# EAGLE schematic Schematic-DONE (EAGLE 9.1.3)
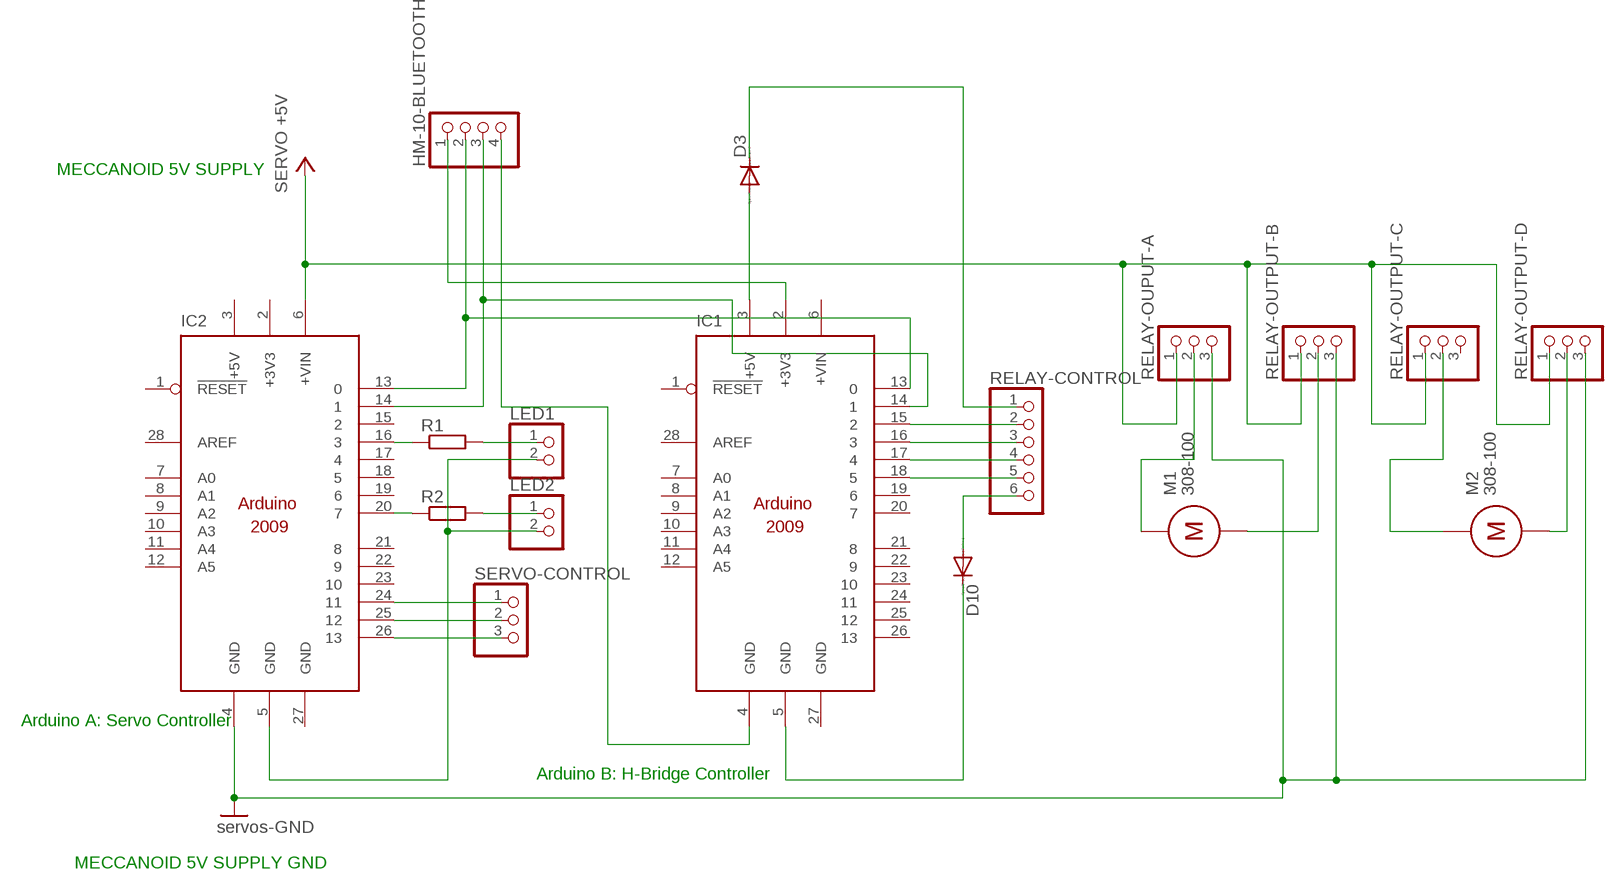
[diagram p0: schematic, sheet 1]

## Parts
D3  1N4148DO35-7  [DO35-7]
D10  1N4148DO35-7  [DO35-7]
HM-10-BLUETOOTH  PINHD-1X4  [1X04]
IC1  ARDUINO2009_10  [ARDUINO2009]
IC2  ARDUINO2009_10  [ARDUINO2009]
LED1  PINHD-1X2  [1X02]
LED2  PINHD-1X2  [1X02]
M1  308-100  [308-100]
M2  308-100  [308-100]
R1  R-EU_0204/2V  [0204V]
R2  R-EU_0204/2V  [0204V]
RELAY-CONTROL  PINHD-1X6  [1X06]
RELAY-OUPUT-A  PINHD-1X3  [1X03]
RELAY-OUTPUT-B  PINHD-1X3  [1X03]
RELAY-OUTPUT-C  PINHD-1X3  [1X03]
RELAY-OUTPUT-D  PINHD-1X3  [1X03]
SERVO-CONTROL  PINHD-1X3  [1X03]

## Nets
+5V: IC2.6(+VIN) RELAY-OUPUT-A.1 RELAY-OUTPUT-B.1 RELAY-OUTPUT-C.1 RELAY-OUTPUT-D.1 ; supply symbol labelled SERVO +5V
GND: IC2.4(GND) RELAY-OUPUT-A.3 RELAY-OUTPUT-B.3 RELAY-OUTPUT-D.3 ; supply symbol labelled servos-GND
N$1: M1.POS RELAY-OUPUT-A.2
N$2: M2.POS RELAY-OUTPUT-C.2
N$3: D3.C RELAY-CONTROL.1
N$4: IC1.15 RELAY-CONTROL.2
N$5: IC1.16 RELAY-CONTROL.3
N$6: IC1.17 RELAY-CONTROL.4
N$7: IC1.18 RELAY-CONTROL.5
N$8: D3.A IC1.3(+5V)
N$9: IC2.16 R1.1
N$10: M1.NEG RELAY-OUTPUT-B.2
N$11: IC2.24 SERVO-CONTROL.1
N$12: D10.C IC1.5(GND)
N$13: IC2.25 SERVO-CONTROL.2
N$15: IC2.26 SERVO-CONTROL.3
N$16: HM-10-BLUETOOTH.1 IC1.2(+3V3)
N$17: D10.A RELAY-CONTROL.6
N$18: HM-10-BLUETOOTH.2 IC1.13 IC2.13
N$19: HM-10-BLUETOOTH.4 IC1.4(GND)
N$20: HM-10-BLUETOOTH.3 IC1.14 IC2.14
N$21: LED1.1 R1.2
N$22: IC2.5(GND) LED1.2 LED2.2
N$23: LED2.1 R2.2
N$24: IC2.20 R2.1
RELAY-OUTPUT-D: M2.NEG RELAY-OUTPUT-D.2
Unconnected: IC1.1(!RESET) IC1.6(+VIN) IC1.7(A0) IC1.8(A1) IC1.9(A2) IC1.10(A3) IC1.11(A4) IC1.12(A5) IC1.19 IC1.20 IC1.21 IC1.22 IC1.23 IC1.24 IC1.25 IC1.26 IC1.28(AREF) IC2.1(!RESET) IC2.7(A0) IC2.8(A1) IC2.9(A2) IC2.10(A3) IC2.11(A4) IC2.12(A5) IC2.15 IC2.17 IC2.18 IC2.19 IC2.21 IC2.22 IC2.23 IC2.28(AREF) RELAY-OUTPUT-C.3

## Notes on the sheet
- MECCANOID 5V SUPPLY
- Arduino A: Servo Controller
- Arduino B: H-Bridge Controller
- MECCANOID 5V SUPPLY GND

## Power pins joined to a net without a drawn wire
+3V3: IC2.2(+3V3)
+5V: IC2.3(+5V)
GND: IC1.27(GND) IC2.27(GND)

## Library data of the parts
D3 D10 = diode:1N4148: DIODE high speed (Philips)
HM-10-BLUETOOTH = pinhead:PINHD-1X4: PIN HEADER
IC1 IC2 = arduino:ARDUINO2009_1: The Arduino Duemilanove ("2009") is a microcontroller board based on the ATmega168 or ATmega328. - 14 digital input/output pins (of which 6 can be used as PWM outputs) - 6 analog inputs, a 16 MHz crystal oscillator - USB connection - power jack - ISP header - reset button It contains everything needed to support the microcontroller; simply connect it to a computer with a USB cable or power it with a AC-to-DC adapter or battery to get started http://arduino.cc/en/Main/ArduinoBoardDuemilanove
LED1 LED2 = pinhead:PINHD-1X2: PIN HEADER
M1 M2 = motor:308-100: Pico Vibe 8mm Vibration Motor - 3mm Type; PRECISION_MICRODRIVES: 308-100
R1 R2 = resistor:R-EU_: RESISTOR, European symbol
RELAY-CONTROL = pinhead:PINHD-1X6: PIN HEADER
RELAY-OUPUT-A RELAY-OUTPUT-B RELAY-OUTPUT-C RELAY-OUTPUT-D SERVO-CONTROL = pinhead:PINHD-1X3: PIN HEADER